# EAGLE design tfttouchshield (EAGLE 9.6.2)
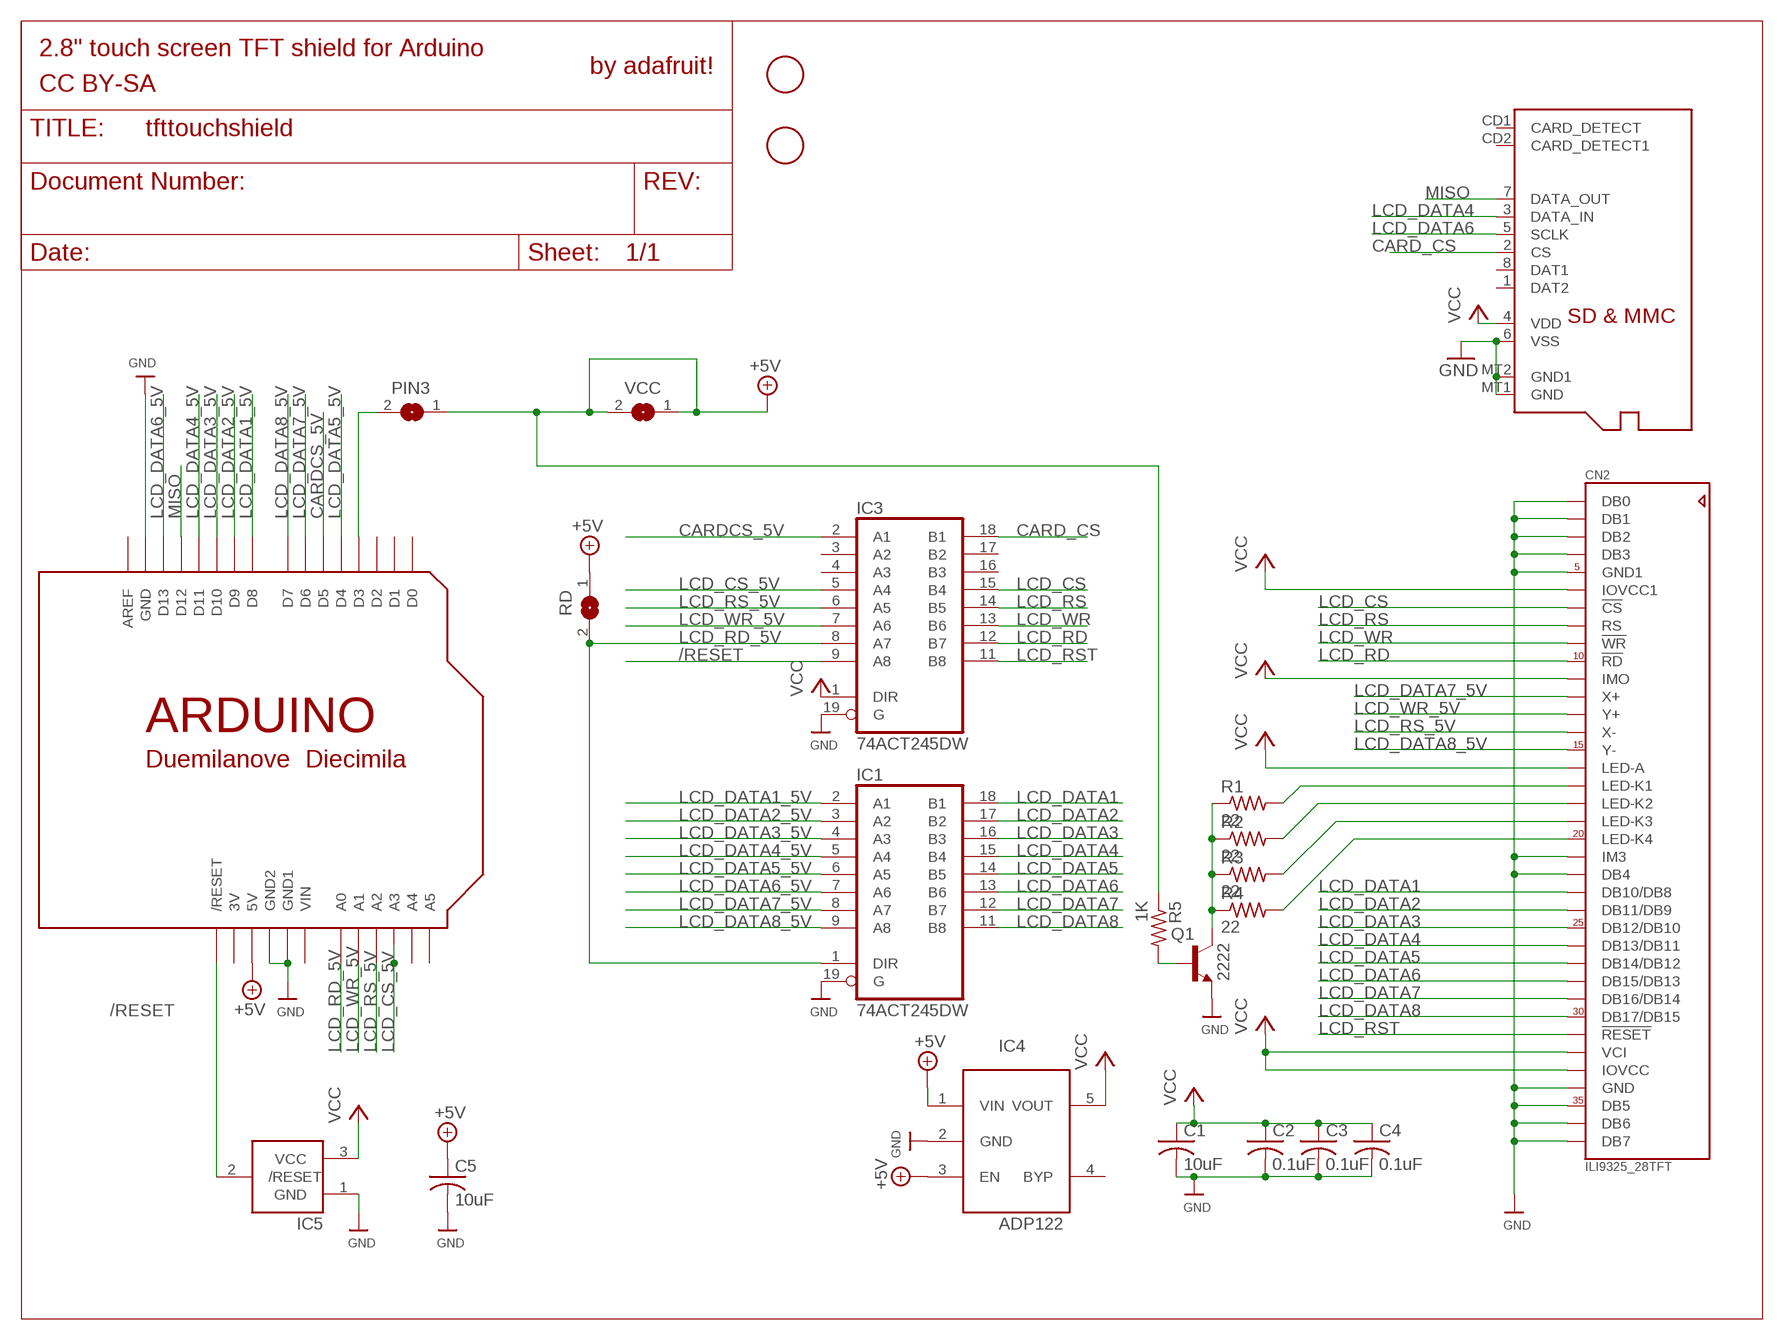
[diagram p0: schematic, sheet 1]

## Parts
C1  10uF  C-USC0805K  [C0805K]
C2  0.1uF  C-USC0805K  [C0805K]
C3  0.1uF  C-USC0805K  [C0805K]
C4  0.1uF  C-USC0805K  [C0805K]
C5  10uF  C-USC0805K  [C0805K]
CN2  ILI9325_28TFT  ILI9325_LCD1.0MM  [ILI9325_28INCH_TS]
IC1  74ACT245DW  [SO20W]
IC3  74ACT245DW  [SO20W]
IC4  ADP122  LP298XS  [SOT23-5L]
IC5  AXP083-SAG  [SOT23]
PIN3  SJ  [SJ]
Q1  2222  MMBT2222ALT1-NPN-SOT23-BEC  [SOT23-BEC]
R1  22  R-US_R0805  [R0805]
R2  22  R-US_R0805  [R0805]
R3  22  R-US_R0805  [R0805]
R4  22  R-US_R0805  [R0805]
R5  1K  R-US_R0805  [R0805]
RD  SJ  [SJ]
U$2  ARDUINO-NOHOLE  [ARDUINO-NOHOLE]
U$3  MICROSD  [MICROSD]
U$10  FIDUCIAL  [FIDUCIAL_1MM]
U$11  FIDUCIAL  [FIDUCIAL_1MM]
VCC  SJ  [SJ]

## Nets
+5V: C5.1 IC4.1(VIN) IC4.3(EN) PIN3.1 R5.1 RD.1 U$2.5V VCC.1 VCC.2
/RESET: IC3.9(A8) IC5.2(/RESET) U$2.RESET(/RESET)
CARD_CS: IC3.18(B1) U$3.2(CS)
CARDCS_5V: IC3.2(A1) U$2.D5
GND: C1.2 C2.2 C3.2 C4.2 C5.2 CN2.1(DB0) CN2.2(DB1) CN2.3(DB2) CN2.4(DB3) CN2.5(GND1) CN2.21(IM3) CN2.22(DB4) CN2.34(GND) CN2.35(DB5) CN2.36(DB6) CN2.37(DB7) IC1.19(G) IC3.19(G) IC4.2(GND) IC5.1(GND) Q1.E U$2.GND U$2.GND1 U$2.GND2 U$3.6(VSS) U$3.MT1(GND) U$3.MT2(GND1)
LCD_CS: CN2.7(!CS) IC3.15(B4)
LCD_CS_5V: IC3.5(A4) U$2.A3
LCD_DATA1: CN2.23(DB10/DB8) IC1.18(B1)
LCD_DATA1_5V: IC1.2(A1) U$2.D8
LCD_DATA2: CN2.24(DB11/DB9) IC1.17(B2)
LCD_DATA2_5V: IC1.3(A2) U$2.D9
LCD_DATA3: CN2.25(DB12/DB10) IC1.16(B3)
LCD_DATA3_5V: IC1.4(A3) U$2.D10
LCD_DATA4: CN2.26(DB13/DB11) IC1.15(B4) U$3.3(DATA_IN)
LCD_DATA4_5V: IC1.5(A4) U$2.D11
LCD_DATA5: CN2.27(DB14/DB12) IC1.14(B5)
LCD_DATA5_5V: IC1.6(A5) U$2.D4
LCD_DATA6: CN2.28(DB15/DB13) IC1.13(B6) U$3.5(SCLK)
LCD_DATA6_5V: IC1.7(A6) U$2.D13
LCD_DATA7: CN2.29(DB16/DB14) IC1.12(B7)
LCD_DATA7_5V: CN2.12(X+) IC1.8(A7) U$2.D6
LCD_DATA8: CN2.30(DB17/DB15) IC1.11(B8)
LCD_DATA8_5V: CN2.15(Y-) IC1.9(A8) U$2.D7
LCD_RD: CN2.10(!RD) IC3.12(B7)
LCD_RD_5V: IC1.1(DIR) IC3.8(A7) RD.2 U$2.A0
LCD_RS: CN2.8(RS) IC3.14(B5)
LCD_RS_5V: CN2.14(X-) IC3.6(A5) U$2.A2
LCD_RST: CN2.31(!RESET) IC3.11(B8)
LCD_WR: CN2.9(!WR) IC3.13(B6)
LCD_WR_5V: CN2.13(Y+) IC3.7(A6) U$2.A1
MISO: U$2.D12 U$3.7(DATA_OUT)
N$1: CN2.20(LED-K4) R4.2
N$2: CN2.17(LED-K1) R1.2
N$3: CN2.18(LED-K2) R2.2
N$4: CN2.19(LED-K3) R3.2
N$5: Q1.C R1.1 R2.1 R3.1 R4.1
N$7: PIN3.2 U$2.D3
N$16: Q1.B R5.2
VCC: C1.1 C2.1 C3.1 C4.1 CN2.6(IOVCC1) CN2.11(IMO) CN2.16(LED-A) CN2.32(VCI) CN2.33(IOVCC) IC3.1(DIR) IC4.5(VOUT) IC5.3(VCC) U$3.4(VDD)
Unconnected: IC3.3(A2) IC3.4(A3) IC3.16(B3) IC3.17(B2) IC4.4(BYP) U$2.A4 U$2.A5 U$2.AREF U$2.D0 U$2.D1 U$2.D2 U$3.1(DAT2) U$3.8(DAT1) U$3.CD1(CARD_DETECT) U$3.CD2(CARD_DETECT1)

## Notes on the sheet
- 2.8" touch screen TFT shield for Arduino
- by adafruit!
- CC BY-SA

## Power pins joined to a net without a drawn wire
3V: U$2.3V
GND: IC1.10(GND) IC3.10(GND)
VCC: IC1.20(VCC) IC3.20(VCC)
VIN: U$2.VIN

## Library data of the parts
C1-C5 = adafruit:C-US: CAPACITOR, American symbol
CN2 = adafruit:ILI9325_LCD: 2.8" ILI9325-based TFT LCD w/Integrated Touch Screen
IC1 IC3 = 74xx-eu:74*245: Octal BUS TRANSCEIVER, 3-state
IC4 = adafruit:LP298X
IC5 = adafruit:AXP083
PIN3 RD VCC = jumper:SJ: SMD solder JUMPER
Q1 = transistor-neu-to92:*-NPN-: NPN Transistror
R1-R5 = rcl:R-US_: RESISTOR, American symbol
U$2 = adafruit:ARDUINO: Arduino Diecimila/Duemilanove Make a shield with ease, this package has all the named pins as well as the two mounting drill holes and an outline of the USB and DC power connector. The outline is on the DIMENSION layer, so if your board house uses it they will cut the outline to match. http://www.ladyada.net/library/pcb/eaglelibrary.html
U$3 = adafruit:MICROSD: Micro-SD / Transflash card holder with SPI pinout For the 3M # 2908-05WB-MG and/or 4UCON #19656 push-push type
U$10 U$11 = adafruit:FIDUCIAL: For use by pick and place machines to calibrate the vision/machine, 1mm By microbuilder.eu

## Board
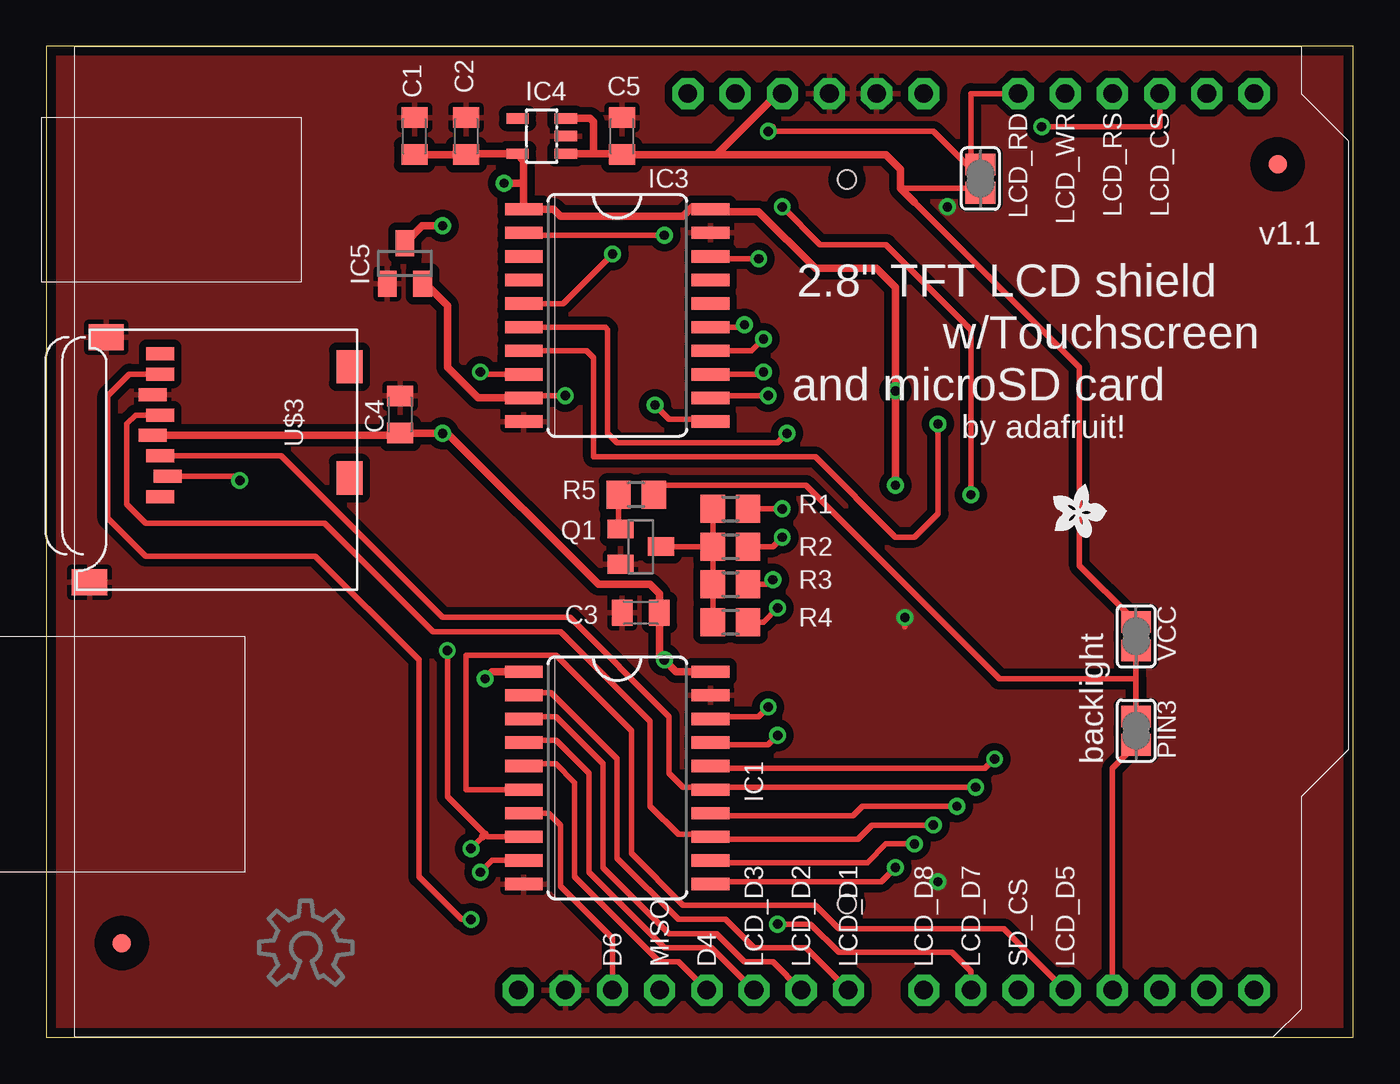
[diagram p1: board, top side]
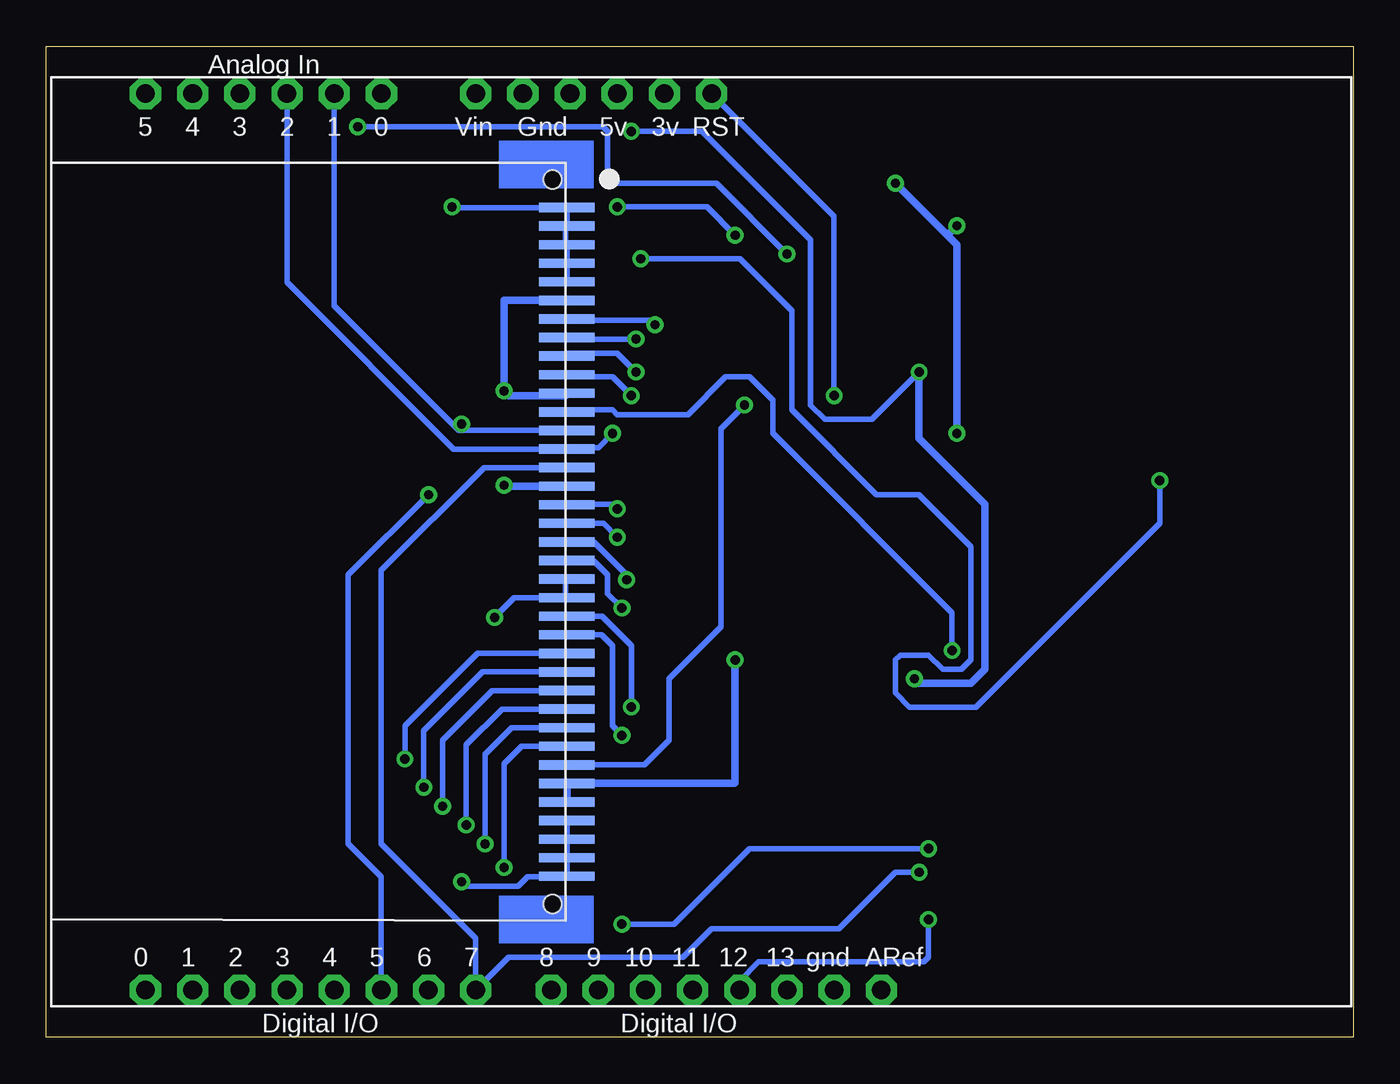
[diagram p2: board, bottom side, seen from below]

Size 70.36 x 53.34 mm. Coordinates in mm from the lower left corner, seen from the top.
Outline: 0,53.34 0,0 70.36,0 70.36,53.34 0,53.34
Copper layers (1*16): Top 0.035mm / dielectric 1.5mm / Bottom 0.035mm
Design rules "default *": minimum track width 10mil, minimum drill 19mil, track to track 12mil, track to pad 12mil, pad to pad 12mil, via to via 12mil, smd to smd 8mil, copper to edge 20mil, drill to drill 8mil, minimum pad ring 10mil, minimum via ring 8mil, stop-mask expansion 4mil, vias tented up to drill 20mil, thermal gap 10mil

### Footprints (pad centres in the part's own frame; a part is rotated, then mirrored left to right if it is on the bottom)
C0805K = smd 1.1 x 1.4: 1 -1,0; 2 1,0
ILI9325_28INCH_TS = smd 0.5 x 3: 1 -18,27.77; 2 -17,27.77; 3 -16,27.77; 4 -15,27.77; 5 -14,27.77; 6 -13,27.77; 7 -12,27.77; 8 -11,27.77; 9 -10,27.77; 10 -9,27.77; 11 -8,27.77; 12 -7,27.77; 13 -6,27.77; 14 -5,27.77; 15 -4,27.77; 16 -3,27.77; 17 -2,27.77; 18 -1,27.77; 19 0,27.77; 20 1,27.77; 21 2,27.77; 22 3,27.77; 23 4,27.77; 24 5,27.77; 25 6,27.77; 26 7,27.77; 27 8,27.77; 28 9,27.77; 29 10,27.77; 30 11,27.77; 31 12,27.77; 32 13,27.77; 33 14,27.77; 34 15,27.77; 35 16,27.77; 36 17,27.77; 37 18,27.77 | hole 1: -19.5,27; 19.5,27
SO20W = smd 0.66 x 2.032: 1 -5.715,-5.029; 2 -4.445,-5.029; 3 -3.175,-5.029; 4 -1.905,-5.029; 5 -0.635,-5.029; 6 0.635,-5.029; 7 1.905,-5.029; 8 3.175,-5.029; 9 4.445,-5.029; 10 5.715,-5.029; 11 5.715,5.029; 12 4.445,5.029; 13 3.175,5.029; 14 1.905,5.029; 15 0.635,5.029; 16 -0.635,5.029; 17 -1.905,5.029; 18 -3.175,5.029; 19 -4.445,5.029; 20 -5.715,5.029
SOT23-5L = smd 0.55 x 1.2: 1 -0.95,-1.3; 2 0,-1.3; 3 0.95,-1.3; 4 0.95,1.3; 5 -0.95,1.3
SOT23 = smd 1 x 1.4: 1 -0.95,-1.1; 2 0.95,-1.1; 3 0,1.1
SJ = smd 1.168 x 1.6: 1 -0.762,0; 2 0.762,0
SOT23-BEC = smd 1 x 1.4: B -0.95,-1.1; C 0,1.1; E 0.95,-1.1
R0805 = smd 1.3 x 1.5: 1 -0.95,0; 2 0.95,0
ARDUINO-NOHOLE = drill 1 pad 1.676 octagon: 3V 35.56,2.54; 5V 38.1,2.54; A0 50.8,2.54; A1 53.34,2.54; A2 55.88,2.54; A3 58.42,2.54; A4 60.96,2.54; A5 63.5,2.54; AREF 23.876,50.8; D0 63.5,50.8; D1 60.96,50.8; D2 58.42,50.8; D3 55.88,50.8; D4 53.34,50.8; D5 50.8,50.8; D6 48.26,50.8; D7 45.72,50.8; D8 41.656,50.8; D9 39.116,50.8; D10 36.576,50.8; D11 34.036,50.8; D12 31.496,50.8; D13 28.956,50.8; GND 26.416,50.8; GND1 43.18,2.54; GND2 40.64,2.54; RESET 33.02,2.54; VIN 45.72,2.54
MICROSD = smd 0.7 x 1.5: 1 9,-10.64; 2 7.9,-10.24; 3 6.8,-10.64; 4 5.7,-11.04; 5 4.6,-10.64; 6 3.5,-11.04; 7 2.4,-10.64; 8 1.3,-10.64 | smd 1.8 x 1.4: CD1 2,-0.44; CD2 8,-0.44 | smd 1.4 x 1.9: MT1 0.4,-13.54; MT2 13.6,-14.44
FIDUCIAL_1MM = smd 1 x 1: 1 0,0

### Placement (x,y rotation side)
C1  19.81,48.51 90 top
C2  22.61,48.51 90 top
C3  32,22.86 180 top
C4  19.05,33.53 90 top
C5  30.99,48.51 90 top
CN2  70.1,26.67 270 bottom
IC1  30.73,13.97 270 top
IC3  30.73,38.86 270 top
IC4  26.67,48.51 90 top
IC5  19.3,41.66 0 top
PIN3  58.67,16.51 270 top
Q1  32,26.42 270 top
R1  36.83,28.45 0 top
R2  36.83,26.42 0 top
R3  36.83,24.38 0 top
R4  36.83,22.35 0 top
R5  31.75,29.21 180 top
RD  50.29,46.23 90 top
U$2  1.52,53.34 180 bottom
U$3  16.76,38.1 270 top
U$7  [ADAFRUIT200MIL]  55.63,28.45 270 top
U$9  [OSHWLOGO_TOL_0.2]  13.97,4.83 0 top
U$10  66.29,46.99 180 top
U$11  4.06,5.08 180 top
VCC  58.67,21.59 270 top

### Tracks (layer width: path | path; a pad name or v marks a point on that pad's centre or on a via)
+5V
  Top 0.305: 46.74,44.96 55.63,36.07 55.63,25.4 58.42,22.61 58.67,22.61 VCC.1 VCC.2 58.67,19.3 | 58.67,19.3 PIN3.1 | 32.7,29.65 R5.1 32.77,29.21 33.27,29.72 40.89,29.72 51.31,19.3 58.67,19.3 | RD.1 50.29,45.72 45.97,45.72
  Top 0.406: 36.07,47.5 39.37,50.8 U$2.5V | 29.46,47.56 IC4.1 | 29.46,47.56 30.67,47.56 30.73,47.5 30.75,47.51 C5.1 36.05,47.51 36.07,47.5 | IC4.3 29.28,49.46 29.46,49.28 29.46,47.56 | 46.74,44.96 45.97,45.72 45.97,46.74 45.21,47.5 36.07,47.5
/RESET  (via drill 0.5)
  Top 0.305: IC3.9 25.65,34.47 25.65,34.54 v27.94,34.54
  Top 0.406: IC3.9 23.24,34.42 21.59,36.07 21.59,39.37 20.4,40.56 IC5.2
  Bottom 0.305: U$2.RESET 27.94,44.2 v27.94,34.54
CARD_CS  (via drill 0.5)
  Top 0.305: U$3.2 10.19,30.2 v10.41,29.97 | IC3.18 35.69,42.04 35.56,41.91 v38.35,41.91
  Bottom 0.305: v10.41,29.97 10.41,27.69 20.32,17.78 23.88,17.78 24.64,18.54 24.64,20.32 24.38,20.57 22.86,20.57 22.1,19.81 21.08,19.81 20.57,20.32 20.57,26.42 23.37,29.21 25.65,29.21 30.23,33.78 30.23,39.12 33.02,41.91 v38.35,41.91
CARDCS_5V  (via drill 0.5)
  Top 0.305: v49.78,29.21 49.78,38.1 45.21,42.67 41.66,42.67 v39.62,44.7 | 25.7,43.38 25.65,43.43 | 25.7,43.38 IC3.2 | v33.27,43.18 25.91,43.18 25.7,43.38
  Bottom 0.305: U$2.D5 52.32,8.64 54.1,10.41 54.1,24.89 v49.78,29.21 | v39.62,44.7 34.8,44.7 v33.27,43.18
GND  (via drill 0.5)
  Top 0.305: v46.23,22.61 46.23,22.1 | v48.01,8.38 48.01,8.64
  Bottom 0.305: CN2.21 42.37,24.64 42.42,24.64 42.42,23.75 CN2.22 45.16,23.67 v46.23,22.61 | 42.42,10.67 | 42.42,10.67 CN2.35 42.33,9.74 42.4,9.67 | 42.42,10.67 42.33,10.75 CN2.34 42.33,8.64 44.45,8.64 44.96,8.13 47.75,8.13 v48.01,8.38 | 42.4,9.67 42.42,9.65 | 42.4,9.67 CN2.36 42.33,8.72 42.38,8.67 | 42.38,8.67 42.42,8.64 | CN2.37 42.38,8.67 | 42.42,43.69 42.4,43.67 CN2.2 | 42.42,43.69 42.33,43.77 CN2.1 48.51,44.67 v48.51,44.7 | 42.42,43.69 42.42,42.67 CN2.3 42.33,41.74 42.4,41.67 | 42.4,41.67 42.42,41.66 | 42.4,41.67 CN2.4 42.33,40.72 42.39,40.67 | 42.39,40.67 42.42,40.64 | 42.39,40.67 CN2.5
  pour Top (isolate 0.406): -0.25,0 -0.25,53.34 70.36,53.34 70.36,0
LCD_CS  (via drill 0.5)
  Top 0.305: IC3.15 37.47,38.23 v37.59,38.35
  Bottom 0.305: 42.4,38.61 42.42,38.61 | 42.4,38.61 CN2.7 | v37.59,38.35 37.85,38.61 42.4,38.61
LCD_CS_5V  (via drill 0.5)
  Top 0.305: 59.94,50.55 U$2.A3 59.94,49.02 v53.59,49.02 | IC3.5 27.81,39.5 v30.48,42.16
  Bottom 0.305: v30.48,42.16 34.29,45.97 39.88,45.97 40.13,46.23 40.13,48.77 40.39,49.02 v53.59,49.02
LCD_DATA1  (via drill 0.5)
  Top 0.305: IC1.18 35.81,17.2 35.81,17.27 38.35,17.27 v38.86,17.78
  Bottom 0.305: CN2.23 40.45,22.67 38.86,21.08 v38.86,17.78
LCD_DATA1_5V
  Top 0.305: U$2.D8 40.89,4.83 38.1,4.83 36.58,6.35 34.04,6.35 30.73,9.65 30.73,14.99 27.18,18.54 25.83,18.54 IC1.2
LCD_DATA2  (via drill 0.5)
  Top 0.305: IC1.17 35.89,15.75 38.86,15.75 v39.37,16.26
  Bottom 0.305: CN2.24 40.47,21.67 39.88,21.08 39.88,16.76 v39.37,16.26
LCD_DATA2_5V
  Top 0.305: U$2.D9 39.12,4.06 37.59,4.06 36.07,5.59 33.53,5.59 29.97,9.14 29.97,14.73 27.43,17.27 25.65,17.27 25.65,17.2 IC1.3
LCD_DATA3  (via drill 0.5)
  Top 0.305: IC1.16 35.81,14.55 35.81,14.48 50.55,14.48 v51.05,14.99
  Bottom 0.305: CN2.25 47.15,20.67 51.05,16.76 v51.05,14.99
LCD_DATA3_5V
  Top 0.305: U$2.D10 35.81,4.83 33.27,4.83 29.21,8.89 29.21,14.22 27.43,16 25.83,16 IC1.4
LCD_DATA4  (via drill 0.5)
  Top 0.305: v50.04,13.46 35.81,13.46 35.76,13.41 IC1.15 35.76,13.26 | U$3.3 12.64,31.3 21.34,22.61 28.19,22.61 33.53,17.27 33.53,14.22 34.29,13.46 35.56,13.46 35.76,13.26 | 35.76,13.26 35.81,13.21
  Bottom 0.305: CN2.26 46.88,19.67 50.04,16.51 v50.04,13.46
LCD_DATA4_5V
  Top 0.305: U$2.D11 34.04,4.06 33.02,4.06 28.45,8.64 28.45,13.72 27.43,14.73 25.83,14.73 IC1.5
LCD_DATA5  (via drill 0.5)
  Top 0.305: v49.02,12.45 43.94,12.45 43.43,11.94 35.81,11.94 35.69,12.06 | 35.69,12.06 35.56,12.19 | IC1.14 35.69,12.06
  Bottom 0.305: CN2.27 46.35,18.67 49.02,16 v49.02,12.45
LCD_DATA5_5V
  Top 0.305: IC1.6 22.61,13.34 22.61,20.57 27.43,20.57 31.5,16.51 31.5,9.91 34.29,7.11 41.4,7.11 42.67,5.84 51.56,5.84 U$2.D4
LCD_DATA6  (via drill 0.5)
  Top 0.305: v47.75,11.43 44.45,11.43 43.69,10.67 35.81,10.67 35.76,10.72 IC1.13 35.69,10.79 35.56,10.92 34.04,10.92 32.51,12.45 32.51,17.02 27.69,21.84 20.83,21.84 14.99,27.69 5.33,27.69 4.32,28.7 4.32,33.02 4.8,33.5 U$3.5
  Bottom 0.305: CN2.28 45.83,17.67 47.75,15.75 v47.75,11.43
LCD_DATA6_5V
  Top 0.305: IC1.7 27.05,12.06 27.69,11.43 27.69,8.13 30.48,5.33 U$2.D13
LCD_DATA7  (via drill 0.5)
  Top 0.305: v46.74,10.41 45.21,10.41 44.2,9.4 35.81,9.4 35.76,9.45 IC1.12
  Bottom 0.305: CN2.29 45.31,16.67 46.74,15.24 v46.74,10.41
LCD_DATA7_5V  (via drill 0.5)
  Top 0.305: v22.86,10.16 23.5,10.79 | IC1.8 23.75,10.79 23.62,10.92 21.59,12.95 v21.59,20.83 | U$2.D6 49.78,3.56 48.77,4.57 42.67,4.57 41.15,6.1 v39.37,6.1
  Top 0.406: 23.5,10.79 23.62,10.92
  Bottom 0.305: v21.59,20.83 21.59,22.86 31.24,32.51 31.24,34.29 32.51,35.56 33.78,35.56 35.81,33.53 39.62,33.53 39.88,33.78 42.16,33.78 42.28,33.67 CN2.12 | v39.37,6.1 36.58,6.1 32.51,10.16 v22.86,10.16
LCD_DATA8  (via drill 0.5)
  Top 0.305: 35.64,8.38 35.56,8.38 | IC1.11 35.64,8.38 | v45.72,9.14 44.96,8.38 35.64,8.38
  Bottom 0.305: CN2.30 44.78,15.67 45.72,14.73 v45.72,9.14
LCD_DATA8_5V  (via drill 0.5)
  Top 0.305: IC1.9 24,9.53 v23.37,8.89
  Bottom 0.305: v23.37,8.89 24.64,8.89 27.69,5.84 34.54,5.84 36.07,4.32 45.47,4.32 U$2.D7 47.24,5.33 52.32,10.41 52.32,25.15 46.8,30.67 CN2.15
LCD_RD  (via drill 0.5)
  Top 0.305: IC3.12 35.89,34.54 v38.86,34.54
  Bottom 0.305: CN2.10 42.42,35.59 42.42,35.56 39.88,35.56 v38.86,34.54
LCD_RD_5V  (via drill 0.5)
  Top 0.305: IC3.8 23.5,35.69 v23.37,35.81 | v38.86,48.77 39.12,49.02 39.12,48.77 47.75,48.77 49.53,46.99 RD.2 | U$2.A0 49.78,50.8 49.78,47.24 50.29,47.24 RD.2 | RD.2 49.78,46.99
  Top 0.406: IC1.1 24,19.68 v23.62,19.3
  Bottom 0.305: v23.37,35.81 25.91,33.27 28.45,33.27 29.21,34.04 29.21,42.93 35.05,48.77 v38.86,48.77
  Bottom 0.406: v23.62,19.3 23.37,19.05 20.57,19.05 19.81,19.81 19.81,28.7 23.37,32.26 v23.37,35.81
LCD_RS  (via drill 0.5)
  Top 0.305: IC3.14 37.97,36.96 v38.61,37.59
  Bottom 0.305: CN2.8 42.24,37.67 42.16,37.59 v38.61,37.59
LCD_RS_5V  (via drill 0.5)
  Top 0.305: IC3.6 30.1,38.23 30.23,38.1 30.23,32.51 30.73,32 39.37,32 v39.88,32.51
  Bottom 0.305: U$2.A2 57.15,50.8 57.4,50.55 57.4,40.64 48.43,31.67 CN2.14 42.42,31.75 40.64,31.75 v39.88,32.51
LCD_RST  (via drill 0.5)
  Top 0.305: IC3.11 35.81,33.2 35.81,33.27 33.53,33.27 v32.77,34.04
  Bottom 0.305: CN2.31 38.16,14.67 36.83,16 36.83,19.3 34.04,22.1 34.04,32.77 v32.77,34.04
LCD_WR  (via drill 0.5)
  Top 0.305: IC3.13 38.48,35.69 v38.61,35.81
  Bottom 0.305: CN2.9 42.42,36.75 42.42,36.83 39.62,36.83 v38.61,35.81
LCD_WR_5V  (via drill 0.5)
  Top 0.305: IC3.7 29.08,36.96 29.46,36.58 29.46,31.24 41.4,31.24 45.72,26.92 46.74,26.92 48.01,28.19 v48.01,33.02
  Bottom 0.305: 47.75,32.67 48.16,32.67 54.86,39.37 54.86,50.55 55.12,50.8 U$2.A1 | 47.75,32.67 CN2.13 | 47.75,32.67 47.75,32.77 v48.01,33.02
MISO  (via drill 0.5)
  Top 0.305: U$3.7 4.46,35.7 3.3,34.54 3.3,27.94 5.33,25.91 14.48,25.91 20.07,20.32 20.07,8.64 22.35,6.35 v22.86,6.35
  Bottom 0.305: v22.86,6.35 22.86,4.32 23.11,4.06 32,4.06 33.02,3.05 U$2.D12
N$1  (via drill 0.5)
  Top 0.305: R4.2 38.61,22.35 v39.37,23.11
  Bottom 0.305: v39.37,23.11 40.13,23.88 40.13,24.89 40.89,25.65 42.35,25.65 | 42.35,25.65 42.67,25.65 | 42.35,25.65 CN2.20
N$2  (via drill 0.5)
  Top 0.305: R1.2 v39.62,28.45
  Bottom 0.305: 42.37,28.7 42.42,28.7 | 42.37,28.7 CN2.17 | v39.62,28.45 39.62,28.7 42.37,28.7
N$3  (via drill 0.5)
  Top 0.305: 39.56,26.92 v39.62,26.92 39.12,26.42 R2.2
  Bottom 0.305: 39.62,26.99 v39.62,26.92 40.37,27.67 CN2.18 42.66,27.67 42.67,27.69
N$4  (via drill 0.5)
  Top 0.305: R3.2 38.86,24.38 v39.12,24.64
  Bottom 0.305: 42.16,26.67 CN2.19 40.89,26.67 39.12,24.89 v39.12,24.64
N$5
  Top 0.305: 35.81,26.42 Q1.C | R1.1 35.88,26.48 35.81,26.42 | R4.1 35.88,24.32 35.81,24.38 R3.1 35.88,26.35 35.81,26.42 | 35.81,26.42 R2.1
N$7
  Top 0.305: PIN3.2 57.4,14.48 U$2.D3
N$16
  Top 0.305: Q1.B 30.92,27.37 30.99,27.43 30.8,27.62 R5.2
VCC  (via drill 0.5)
  Top 0.406: C1.1 20.05,47.51 20.07,47.5 20.08,47.51 C2.1 22.61,47.5 22.67,47.56 IC4.5 25.37,47.53 25.7,47.19 IC3.1 | 35.76,44.5 35.81,44.45 38.35,44.45 41.4,41.4 44.7,41.4 45.72,40.39 v45.72,34.8 v45.72,29.72 | 35.76,44.5 IC3.20 35.89,44.7 | IC3.1 27.3,44.58 27.69,44.2 34.29,44.2 34.8,44.7 35.89,44.7 | 35.76,44.5 35.69,44.58 | U$3.4 18.94,32.4 19.05,32.51 C4.1 21.34,32.53 | C3.1 33,22.37 | 21.34,32.53 21.57,32.53 29.72,24.38 32.51,24.38 33.02,23.88 33.02,22.88 C3.1 | IC1.20 33.91,19.68 v33.27,20.32 33.02,20.57 33.02,22.84 C3.1 | IC3.1 25.7,45.97 v24.64,45.97 | 21.34,32.53 v21.34,32.51 | 35.89,44.7 36.07,44.7 | IC5.3 20.24,43.69 v21.34,43.69
  Bottom 0.406: 42.21,13.67 42.16,13.72 | 42.21,13.67 CN2.32 33.32,13.67 33.27,13.72 v33.27,20.32 | CN2.33 42.33,13.55 42.21,13.67 | CN2.16 45.77,29.67 v45.72,29.72 | CN2.11 42.42,34.59 42.42,34.54 45.47,34.54 v45.72,34.8 45.72,39.67 CN2.6 | 21.84,43.18 21.34,42.67 v21.34,32.51 | 21.84,43.18 v24.64,45.97 | 21.84,43.18 v21.34,43.69

### Text on the board
tPlace: LCD_RD | LCD_WR | LCD_RS | LCD_CS | v1.1 | 2.8" TFT LCD shield | w/Touchscreen | and microSD card | by adafruit! | backlight | D6 | MISO | D4 | LCD_D3 | LCD_D2 | LCD_D1 | LCD_D8 | LCD_D7 | SD_CS | LCD_D5